# Altium schematic sheet AUX_POWER_-5V.SchDoc
size A4
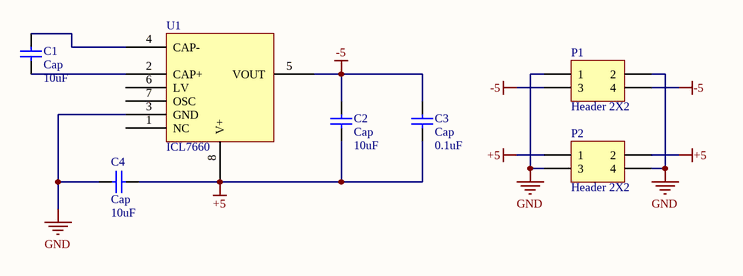
[diagram p0: AUX_POWER_-5V.SchDoc]

## Parts
C1  Cap  value 10uF  [C1206]
C2  Cap  value 10uF  [C1206]
C3  Cap  value 0.1uF  [C1206]
C4  Cap  value 10uF  [C1206]
P1  Header 2X2  [HDR2X2]
P2  Header 2X2  [HDR2X2]
U1  ICL7660  [DIP-8]

## Nets
+5: C2.1 C3.1 C4.1 P2.1 P2.2 U1.8(V+)
-5: C2.2 C3.2 P1.3 P1.4 U1.5(VOUT)
GND: C4.2 P1.1 P1.2 P2.3 P2.4 U1.3(GND)
NetC1_1: C1.1 U1.2(CAP+)
NetC1_2: C1.2 U1.4(CAP-)

Not connected (* = marked no-connect by the designer): U1 1(NC) 6(LV) 7(OSC)

## Library data of the parts
C1-C4 = Cap: Capacitor; Published: 8-Jun-2000; LatestRevisionDate: 17-Jul-2002; LatestRevisionNote: Re-released for DXP Platform.; PackageReference: RAD-0.3; Publisher: Altium Limited; PackageDescription: Radial Cap, Thru-Hole; 2 Leads; 0.3 in Pin Spacing
P1 P2 = Header 2X2: Header, 2-Pin, Dual row; LatestRevisionDate: 17-Jul-2002; LatestRevisionNote: Re-released for DXP Platform.; Publisher: Altium Limited